# EAGLE design sixteenMotors (EAGLE 7.2.0)
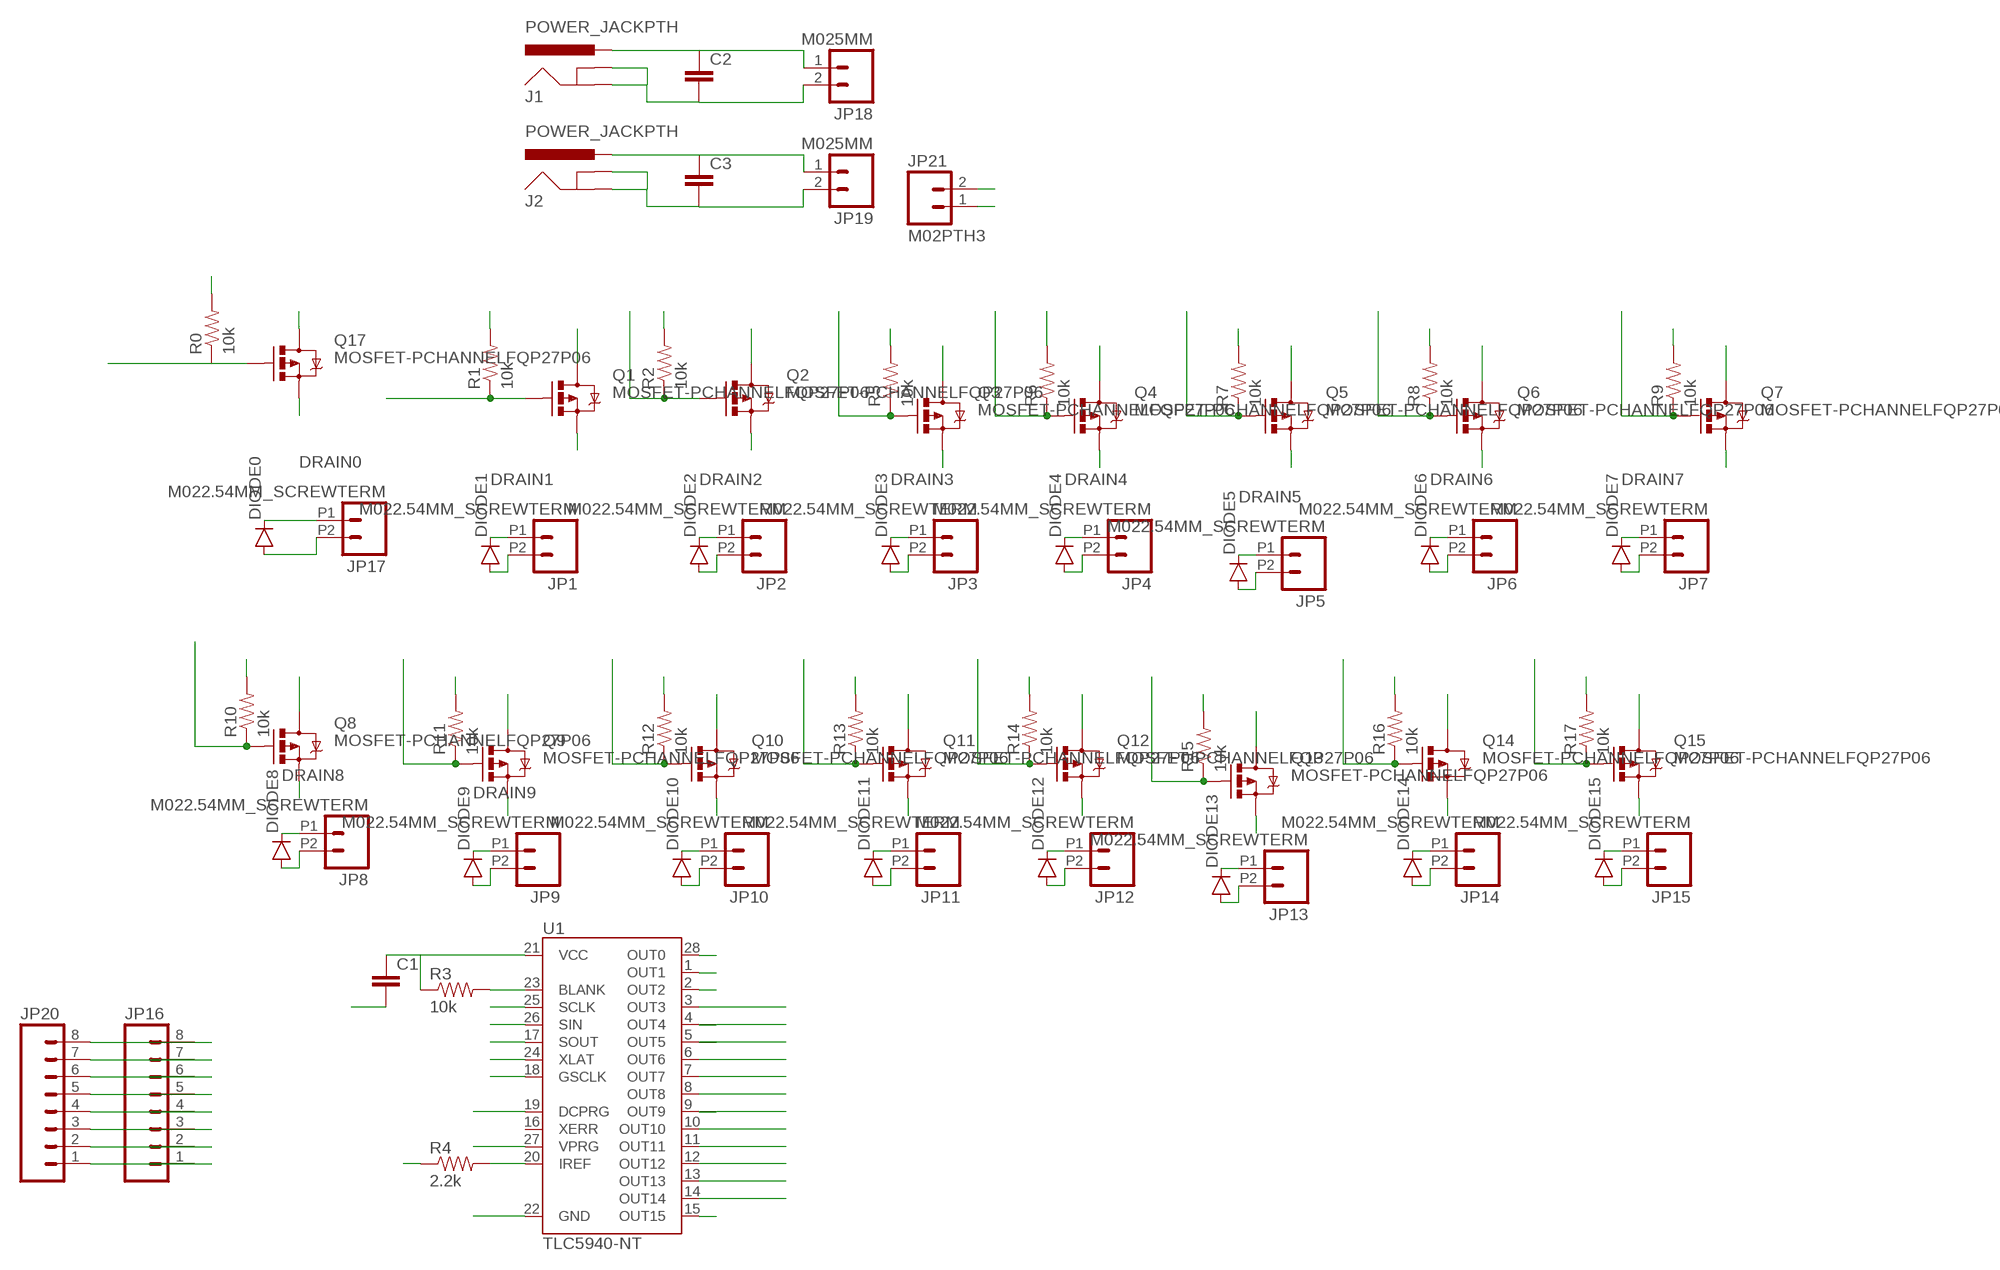
[diagram p0: schematic, sheet 1]

## Parts
C1  CAPEZ  [CAP-PTH-SMALLEZ]
C2  CAPPTH3  [CAP-PTH-LARGE]
C3  CAPPTH3  [CAP-PTH-LARGE]
DIODE0  DIODEPTH  [DIODE-1N4001]
DIODE1  DIODEPTH  [DIODE-1N4001]
DIODE2  DIODEPTH  [DIODE-1N4001]
DIODE3  DIODEPTH  [DIODE-1N4001]
DIODE4  DIODEPTH  [DIODE-1N4001]
DIODE5  DIODEPTH  [DIODE-1N4001]
DIODE6  DIODEPTH  [DIODE-1N4001]
DIODE7  DIODEPTH  [DIODE-1N4001]
DIODE8  DIODEPTH  [DIODE-1N4001]
DIODE9  DIODEPTH  [DIODE-1N4001]
DIODE10  DIODEPTH  [DIODE-1N4001]
DIODE11  DIODEPTH  [DIODE-1N4001]
DIODE12  DIODEPTH  [DIODE-1N4001]
DIODE13  DIODEPTH  [DIODE-1N4001]
DIODE14  DIODEPTH  [DIODE-1N4001]
DIODE15  DIODEPTH  [DIODE-1N4001]
J1  POWER_JACKPTH  [POWER_JACK_PTH]
J2  POWER_JACKPTH  [POWER_JACK_PTH]
JP1  M022.54MM_SCREWTERM  [1X02_2.54_SCREWTERM]
JP2  M022.54MM_SCREWTERM  [1X02_2.54_SCREWTERM]
JP3  M022.54MM_SCREWTERM  [1X02_2.54_SCREWTERM]
JP4  M022.54MM_SCREWTERM  [1X02_2.54_SCREWTERM]
JP5  M022.54MM_SCREWTERM  [1X02_2.54_SCREWTERM]
JP6  M022.54MM_SCREWTERM  [1X02_2.54_SCREWTERM]
JP7  M022.54MM_SCREWTERM  [1X02_2.54_SCREWTERM]
JP8  M022.54MM_SCREWTERM  [1X02_2.54_SCREWTERM]
JP9  M022.54MM_SCREWTERM  [1X02_2.54_SCREWTERM]
JP10  M022.54MM_SCREWTERM  [1X02_2.54_SCREWTERM]
JP11  M022.54MM_SCREWTERM  [1X02_2.54_SCREWTERM]
JP12  M022.54MM_SCREWTERM  [1X02_2.54_SCREWTERM]
JP13  M022.54MM_SCREWTERM  [1X02_2.54_SCREWTERM]
JP14  M022.54MM_SCREWTERM  [1X02_2.54_SCREWTERM]
JP15  M022.54MM_SCREWTERM  [1X02_2.54_SCREWTERM]
JP16  M08  [1X08_PIN1_NO_SILK]
JP17  M022.54MM_SCREWTERM  [1X02_2.54_SCREWTERM]
JP18  M025MM  [SCREWTERMINAL-5MM-2]
JP19  M025MM  [SCREWTERMINAL-5MM-2]
JP20  M08  [1X08_PIN1_NO_SILK]
JP21  M02PTH3  [1X02_LONGPADS]
Q1  MOSFET-PCHANNELFQP27P06  [TO220V]
Q2  MOSFET-PCHANNELFQP27P06  [TO220V]
Q3  MOSFET-PCHANNELFQP27P06  [TO220V]
Q4  MOSFET-PCHANNELFQP27P06  [TO220V]
Q5  MOSFET-PCHANNELFQP27P06  [TO220V]
Q6  MOSFET-PCHANNELFQP27P06  [TO220V]
Q7  MOSFET-PCHANNELFQP27P06  [TO220V]
Q8  MOSFET-PCHANNELFQP27P06  [TO220V]
Q9  MOSFET-PCHANNELFQP27P06  [TO220V]
Q10  MOSFET-PCHANNELFQP27P06  [TO220V]
Q11  MOSFET-PCHANNELFQP27P06  [TO220V]
Q12  MOSFET-PCHANNELFQP27P06  [TO220V]
Q13  MOSFET-PCHANNELFQP27P06  [TO220V]
Q14  MOSFET-PCHANNELFQP27P06  [TO220V]
Q15  MOSFET-PCHANNELFQP27P06  [TO220V]
Q17  MOSFET-PCHANNELFQP27P06  [TO220V]
R0  10k  10KOHM-1/4W5%(PTH)  [AXIAL-0.3]
R1  10k  10KOHM-1/4W5%(PTH)  [AXIAL-0.3]
R2  10k  10KOHM-1/4W5%(PTH)  [AXIAL-0.3]
R3  10k  RESISTORPTH-1/4W  [AXIAL-0.4]
R4  2.2k  RESISTORPTH-1/4W  [AXIAL-0.4]
R5  10k  10KOHM-1/4W5%(PTH)  [AXIAL-0.3]
R6  10k  10KOHM-1/4W5%(PTH)  [AXIAL-0.3]
R7  10k  10KOHM-1/4W5%(PTH)  [AXIAL-0.3]
R8  10k  10KOHM-1/4W5%(PTH)  [AXIAL-0.3]
R9  10k  10KOHM-1/4W5%(PTH)  [AXIAL-0.3]
R10  10k  10KOHM-1/4W5%(PTH)  [AXIAL-0.3]
R11  10k  10KOHM-1/4W5%(PTH)  [AXIAL-0.3]
R12  10k  10KOHM-1/4W5%(PTH)  [AXIAL-0.3]
R13  10k  10KOHM-1/4W5%(PTH)  [AXIAL-0.3]
R14  10k  10KOHM-1/4W5%(PTH)  [AXIAL-0.3]
R15  10k  10KOHM-1/4W5%(PTH)  [AXIAL-0.3]
R16  10k  10KOHM-1/4W5%(PTH)  [AXIAL-0.3]
R17  10k  10KOHM-1/4W5%(PTH)  [AXIAL-0.3]
U1  TLC5940-NT  [DIL28-3]

## Nets
BLANK: JP16.5 JP20.5 R3.P$2 U1.23(BLANK)
DRAIN0: DIODE0.C JP17.P1 Q17.2(D)
DRAIN1: DIODE1.C JP1.P1 Q1.2(D)
DRAIN2: DIODE2.C JP2.P1 Q2.2(D)
DRAIN3: DIODE3.C JP3.P1 Q3.2(D)
DRAIN4: DIODE4.C JP4.P1 Q4.2(D)
DRAIN5: DIODE5.C JP5.P1 Q5.2(D)
DRAIN6: DIODE6.C JP6.P1 Q6.2(D)
DRAIN7: DIODE7.C JP7.P1 Q7.2(D)
DRAIN8: DIODE8.C JP8.P1 Q8.2(D)
DRAIN9: DIODE9.C JP9.P1 Q9.2(D)
DRAIN10: DIODE10.C JP10.P1 Q10.2(D)
DRAIN11: DIODE11.C JP11.P1 Q11.2(D)
DRAIN12: DIODE12.C JP12.P1 Q12.2(D)
DRAIN13: DIODE13.C JP13.P1 Q13.2(D)
DRAIN14: DIODE14.C JP14.P1 Q14.2(D)
DRAIN15: DIODE15.C JP15.P1 Q15.2(D)
GND: C1.2 C2.2 C3.2 DIODE0.A DIODE1.A DIODE2.A DIODE3.A DIODE4.A DIODE5.A DIODE6.A DIODE7.A DIODE8.A DIODE9.A DIODE10.A DIODE11.A DIODE12.A DIODE13.A DIODE14.A DIODE15.A J1.GND J1.GNDBREAK J2.GND J2.GNDBREAK JP1.P2 JP2.P2 JP3.P2 JP4.P2 JP5.P2 JP6.P2 JP7.P2 JP8.P2 JP9.P2 JP10.P2 JP11.P2 JP12.P2 JP13.P2 JP14.P2 JP15.P2 JP16.4 JP17.P2 JP18.2 JP19.2 JP20.4 R4.P$1 U1.22(GND) U1.27(VPRG)
GSCLK: JP16.2 JP20.2 U1.18(GSCLK)
N$2: R4.P$2 U1.20(IREF)
O0: Q17.1(G) R0.P$1 U1.28(OUT0)
O1: Q1.1(G) R1.P$1 U1.1(OUT1)
O2: Q2.1(G) R2.P$1 U1.2(OUT2)
O3: Q3.1(G) R5.P$1 U1.3(OUT3)
O4: Q4.1(G) R6.P$1 U1.4(OUT4)
O5: Q5.1(G) R7.P$1 U1.5(OUT5)
O6: Q6.1(G) R8.P$1 U1.6(OUT6)
O7: Q7.1(G) R9.P$1 U1.7(OUT7)
O8: Q8.1(G) R10.P$1 U1.8(OUT8)
O9: Q9.1(G) R11.P$1 U1.9(OUT9)
O10: Q10.1(G) R12.P$1 U1.10(OUT10)
O11: Q11.1(G) R13.P$1 U1.11(OUT11)
O12: Q12.1(G) R14.P$1 U1.12(OUT12)
O13: Q13.1(G) R15.P$1 U1.13(OUT13)
O14: Q14.1(G) R16.P$1 U1.14(OUT14)
O15: Q15.1(G) R17.P$1 U1.15(OUT15)
POWER1: C2.1 J1.PWR JP18.1 JP21.2 Q1.3(S) Q2.3(S) Q3.3(S) Q4.3(S) Q5.3(S) Q6.3(S) Q7.3(S) Q17.3(S) R0.P$2 R1.P$2 R2.P$2 R5.P$2 R6.P$2 R7.P$2 R8.P$2 R9.P$2
POWER2: C3.1 J2.PWR JP19.1 JP21.1 Q8.3(S) Q9.3(S) Q10.3(S) Q11.3(S) Q12.3(S) Q13.3(S) Q14.3(S) Q15.3(S) R10.P$2 R11.P$2 R12.P$2 R13.P$2 R14.P$2 R15.P$2 R16.P$2 R17.P$2
SCLK: JP16.7 JP20.7 U1.25(SCLK)
SIN: JP16.8 JP20.8 U1.26(SIN)
SOUT: JP16.1 JP20.1 U1.17(SOUT)
VCC: C1.1 JP16.3 JP20.3 R3.P$1 U1.19(DCPRG) U1.21(VCC)
XLAT: JP16.6 JP20.6 U1.24(XLAT)
Unconnected: U1.16(XERR)

## Library data of the parts
C1 = SparkFun-Passives:CAP: Capacitor Standard 0603 ceramic capacitor, and 0.1" leaded capacitor.
C2 C3 = SparkFun-Capacitors:CAP: Capacitor Standard 0603 ceramic capacitor, and 0.1" leaded capacitor.
DIODE0 DIODE1-DIODE15 = SparkFun-DiscreteSemi:DIODE: Diode These are standard reverse protection diodes and small signal diodes. SMA package can handle up to about 1A. SOD-323 can handle about 200mA. What the SOD-323 package when ordering, there are some mfgs out there that are 5-pin packages.
J1 J2 = SparkFun-Connectors:POWER_JACK: Power Jack This is the standard 5.5mm barrel jack for power. The PTH is the most common, proven, reliable, footprint. The Slot footprint only works if the mill layer is transmitted to the PCB fab house so be warned. Mating wall wart : TOL-00298 (and others); PROD_ID: PRT-00119
JP1-JP15 JP17 JP21 = SparkFun-Connectors:M02: Standard 2-pin 0.1" header. Use with - straight break away headers ( PRT-00116) - right angle break away headers (PRT-00553) - swiss pins (PRT-00743) - machine pins (PRT-00117) - female headers (PRT-00115) Molex polarized connector foot print use with: PRT-08233 with associated crimp pins and housings. 2.54_SCREWTERM for use with PRT-10571. 3.5mm Screw Terminal footprints for PRT-08084 5mm Screw Terminal footprints for use with PRT-08432
JP16 JP20 = SparkFun-Connectors:M08: Header 8 Standard 8-pin 0.1" header. Use with straight break away headers (SKU : PRT-00116), right angle break away headers (PRT-00553), swiss pins (PRT-00743), machine pins (PRT-00117), and female headers (PRT-00115).
JP18 JP19 = SparkFun-Connectors:M02: Standard 2-pin 0.1" header. Use with - straight break away headers ( PRT-00116) - right angle break away headers (PRT-00553) - swiss pins (PRT-00743) - machine pins (PRT-00117) - female headers (PRT-00115) Molex polarized connector foot print use with: PRT-08233 with associated crimp pins and housings. 2.54_SCREWTERM for use with PRT-10571. 3.5mm Screw Terminal footprints for PRT-08084 5mm Screw Terminal footprints for use with PRT-08432; STOREFRONT_ID: PRT-08432
Q1-Q15 Q17 = SparkFun-DiscreteSemi:MOSFET-PCHANNEL: Generic PMOSFET IRLML2244 - TRANS-11153 (SOT-23 -20V -4.3A) (1.Gate 2.Source 3.Drain) FQP27P06 - COM-10349 <http://www.sparkfun.com/products/10349> (TO-220 -60V -27A) (1.Gate 2.Source 3.Drain)
R0 R1 R2 R5-R17 = SparkFun-Resistors:10KOHM-1/4W5%(PTH): RES-09435; PROD_ID: RES-9435
R3 R4 = SparkFun-Passives:RESISTOR: Resistor Basic schematic elements and footprints for 0603, 1206, and PTH resistors.
U1 = SparkFun-DigitalIC:TLC5940: 16-channel LED Driver with Dot Correction and Grayscale PWM Control The TLC5940 is a 16-channel, constant-current sink LED driver. Each channel has an individually adjustable 4096-step grayscale PWM brightness control and a 64-step, constant-current sink (dot correction). The dot correction adjusts the brightness variations between LED channels and other LED drivers. The dot correction data is stored in an integrated EEPROM. Both grayscale control and dot correction are accessible via a serial interface. A single external resistor sets the maximum current value of all 16 channels. Packages: 28-pin HTSSOP 32-pin 5x5mm QFN 28-pin DIP

## Board
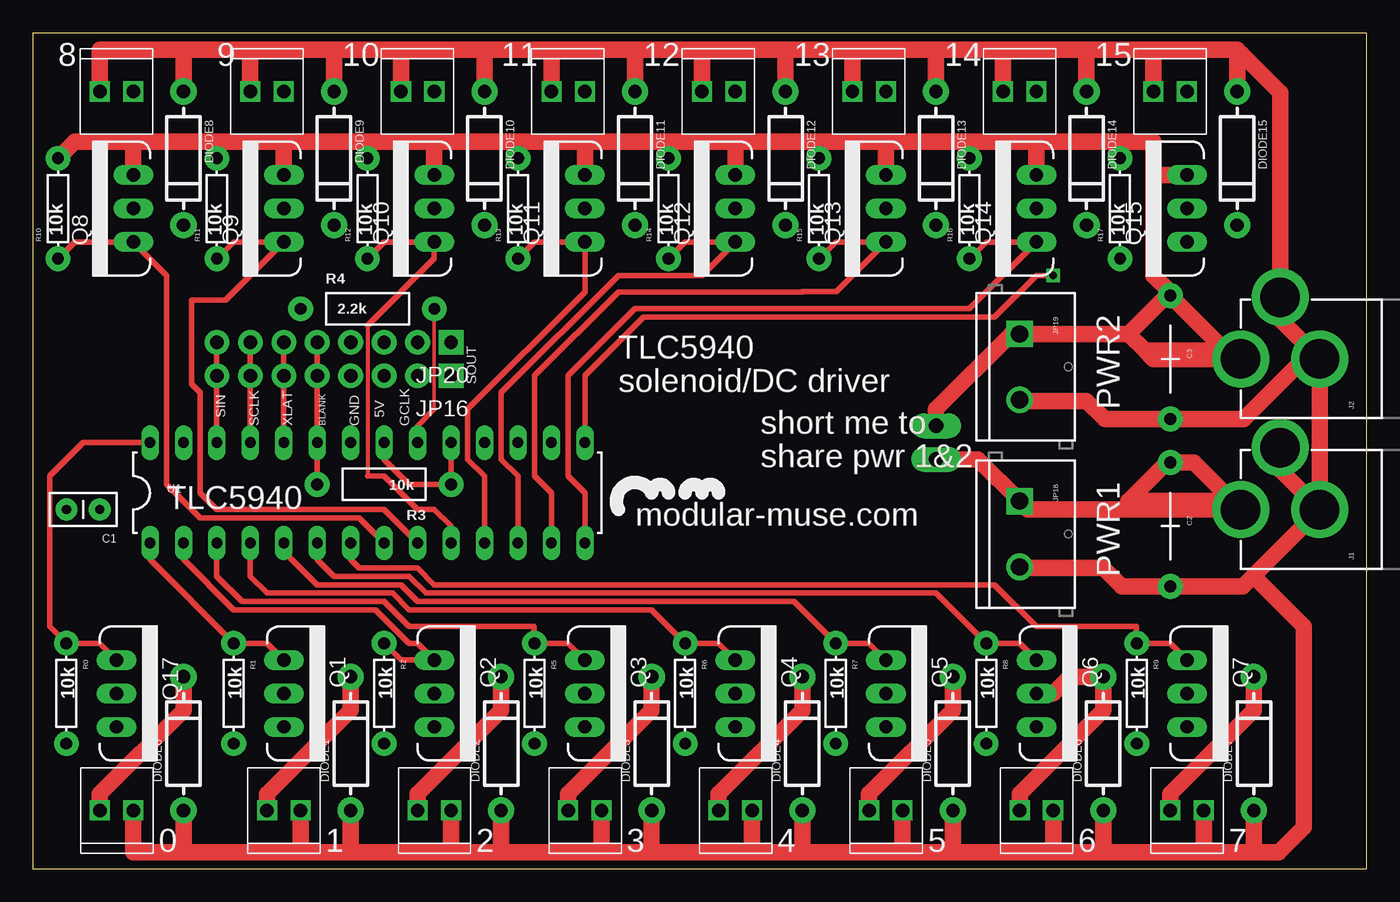
[diagram p1: board, top side]
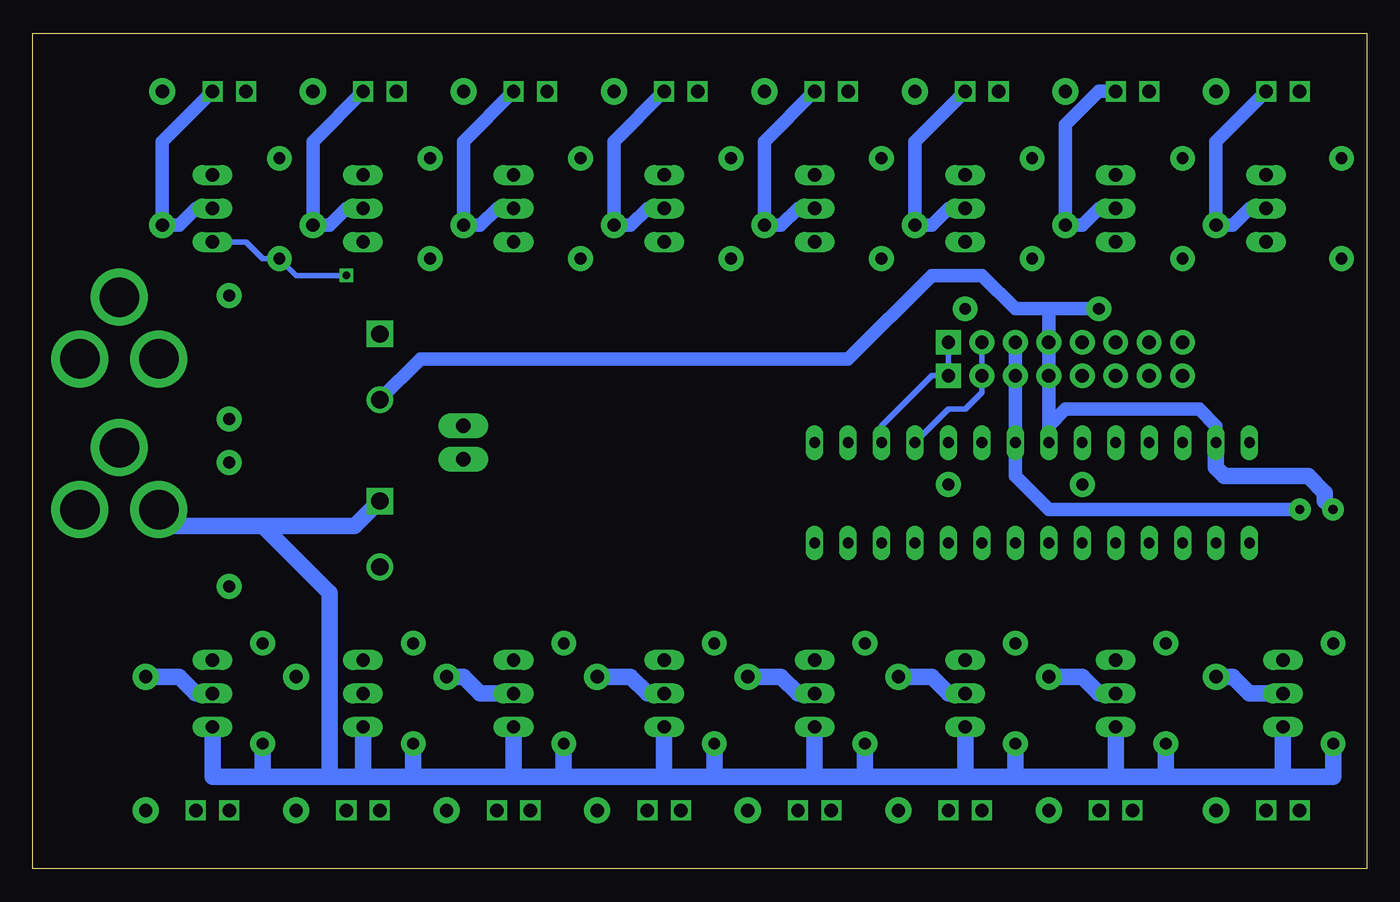
[diagram p2: board, bottom side, seen from below]

Size 101.27 x 63.49 mm. Coordinates in mm from the lower left corner, seen from the top.
Outline: 0,0 101.27,0 101.27,63.49 0,63.49 0,0
Copper layers (1*16): Top 0.035mm / dielectric 1.5mm / Bottom 0.035mm
Design rules "default": minimum track width 10mil, minimum drill 24mil, track to track 8mil, track to pad 8mil, pad to pad 8mil, via to via 8mil, smd to smd 8mil, copper to edge 40mil, drill to drill 8mil, minimum pad ring 10mil, minimum via ring 8mil, stop-mask expansion 4mil, vias tented up to drill 0mil, thermal gap 10mil

### Footprints (pad centres in the part's own frame; a part is rotated, then mirrored left to right if it is on the bottom)
CAP-PTH-SMALLEZ = drill 0.7 pad 1.651: 1 0,0; 2 2.54,0
CAP-PTH-LARGE = drill 0.9 pad 1.905: 1 -4.826,0; 2 4.572,0
DIODE-1N4001 = drill 1 pad 1.981: A -5.08,0; C 5.08,0
POWER_JACK_PTH = drill 2.997 pad 4.318: GND 0,7.7; GNDBREAK 4.7,10.7; PWR 0,13.7
1X02_2.54_SCREWTERM = drill 1.016 square: P1 2.54,0; P2 0,0
1X08_PIN1_NO_SILK = drill 1.016 pad 1.88 square: 1 0,0 | drill 1.016 pad 1.88: 2 2.54,0; 3 5.08,0; 4 7.62,0; 5 10.16,0; 6 12.7,0; 7 15.24,0; 8 17.78,0
SCREWTERMINAL-5MM-2 = drill 1.3 pad 2.032 square: 1 0,0 | drill 1.3 pad 2.032: 2 5,0
1X02_LONGPADS = drill 1.118 pad 1.88 long: 1 0,0; 2 2.54,0
TO220V = drill 1.016 long: 1 -2.54,0; 2 0,0; 3 2.54,0
AXIAL-0.3 = drill 0.9 pad 1.88: P$1 -3.81,0; P$2 3.81,0
AXIAL-0.4 = drill 0.9 pad 1.88: P$1 -5.08,0; P$2 5.08,0
DIL28-3 = drill 0.813 long: 1 -16.51,-3.81; 2 -13.97,-3.81; 3 -11.43,-3.81; 4 -8.89,-3.81; 5 -6.35,-3.81; 6 -3.81,-3.81; 7 -1.27,-3.81; 8 1.27,-3.81; 9 3.81,-3.81; 10 6.35,-3.81; 11 8.89,-3.81; 12 11.43,-3.81; 13 13.97,-3.81; 14 16.51,-3.81; 15 16.51,3.81; 16 13.97,3.81; 17 11.43,3.81; 18 8.89,3.81; 19 6.35,3.81; 20 3.81,3.81; 21 1.27,3.81; 22 -1.27,3.81; 23 -3.81,3.81; 24 -6.35,3.81; 25 -8.89,3.81; 26 -11.43,3.81; 27 -13.97,3.81; 28 -16.51,3.81

### Placement (x,y rotation side)
C1  5.08,27.3 180 top
C2  86.36,26.03 270 top
C3  86.36,38.73 270 top
DIODE0  11.43,9.52 90 top
DIODE1  24.13,9.52 90 top
DIODE2  35.56,9.52 90 top
DIODE3  46.99,9.52 90 top
DIODE4  58.42,9.52 90 top
DIODE5  69.85,9.52 90 top
DIODE6  81.28,9.52 90 top
DIODE7  92.71,9.52 90 top
DIODE8  11.43,53.98 270 top
DIODE9  22.86,53.98 270 top
DIODE10  34.29,53.98 270 top
DIODE11  45.72,53.98 270 top
DIODE12  57.15,53.98 270 top
DIODE13  68.58,53.98 270 top
DIODE14  80.01,53.98 270 top
DIODE15  91.44,53.98 270 top
J1  105.41,27.3 90 top
J2  105.41,38.73 90 top
JP1  20.32,4.45 180 top
JP2  31.75,4.45 180 top
JP3  43.18,4.45 180 top
JP4  54.61,4.45 180 top
JP5  66.04,4.45 180 top
JP6  77.47,4.45 180 top
JP7  88.9,4.45 180 top
JP8  5.08,59.05 0 top
JP9  16.51,59.05 0 top
JP10  27.94,59.05 0 top
JP11  39.37,59.05 0 top
JP12  50.8,59.05 0 top
JP13  62.23,59.05 0 top
JP14  73.66,59.05 0 top
JP15  85.09,59.05 0 top
JP16  31.75,37.46 180 top
JP17  7.62,4.45 180 top
JP18  74.93,27.94 270 top
JP19  74.93,40.64 270 top
JP20  31.75,40.01 180 top
JP21  68.58,33.66 270 top
Q1  19.05,13.34 270 top
Q2  30.48,13.34 270 top
Q3  41.91,13.34 270 top
Q4  53.34,13.34 270 top
Q5  64.77,13.34 270 top
Q6  76.2,13.34 270 top
Q7  87.63,13.34 270 top
Q8  7.62,50.16 90 top
Q9  19.05,50.16 90 top
Q10  30.48,50.16 90 top
Q11  41.91,50.16 90 top
Q12  53.34,50.16 90 top
Q13  64.77,50.16 90 top
Q14  76.2,50.16 90 top
Q15  87.63,50.16 90 top
Q17  6.35,13.34 270 top
R0  2.54,13.34 270 top
R1  15.24,13.34 270 top
R2  26.67,13.34 270 top
R3  26.67,29.21 180 top
R4  25.4,42.55 0 top
R5  38.1,13.34 270 top
R6  49.53,13.34 270 top
R7  60.96,13.34 270 top
R8  72.39,13.34 270 top
R9  83.82,13.34 270 top
R10  1.91,50.16 90 top
R11  13.97,50.16 90 top
R12  25.4,50.16 90 top
R13  36.83,50.16 90 top
R14  48.26,50.16 90 top
R15  59.69,50.16 90 top
R16  71.12,50.16 90 top
R17  82.55,50.16 90 top
U1  25.4,28.57 0 top

### Tracks (layer width: path | path; a pad name or v marks a point on that pad's centre or on a via)
BLANK
  Top 0.406: U1.23 R3.P$2 JP16.5 JP20.5
DRAIN0
  Top 1.27: JP17.P1 5.08,5.71 11.43,12.06 DIODE0.C
  Bottom 1.27: Q17.2 8.89,13.34 10.16,14.61 DIODE0.C
DRAIN1
  Top 1.27: JP1.P1 17.78,5.71 24.13,12.06 DIODE1.C
  Bottom 1.27: Q1.2 20.32,13.34 21.59,14.61 DIODE1.C
DRAIN2
  Top 1.27: JP2.P1 29.21,5.71 35.56,12.06 DIODE2.C
  Bottom 1.27: Q2.2 31.75,13.34 33.02,14.61 DIODE2.C
DRAIN3
  Top 1.27: JP3.P1 40.64,5.71 46.99,12.06 DIODE3.C
  Bottom 1.27: Q3.2 43.18,13.34 44.45,14.61 DIODE3.C
DRAIN4
  Top 1.27: JP4.P1 52.07,5.71 58.42,12.06 DIODE4.C
  Bottom 1.27: Q4.2 54.61,13.34 55.88,14.61 DIODE4.C
DRAIN5
  Top 1.27: JP5.P1 63.5,5.71 69.85,12.06 DIODE5.C
  Bottom 1.27: Q5.2 67.31,13.34 68.58,14.61 DIODE5.C
DRAIN6
  Top 1.27: JP6.P1 74.93,5.71 81.28,12.06 DIODE6.C 78.74,14.61 77.47,13.34 Q6.2
DRAIN7
  Top 1.27: JP7.P1 86.36,5.71 92.71,12.06 DIODE7.C
  Bottom 1.27: Q7.2 88.9,13.34 90.17,14.61 DIODE7.C
DRAIN8
  Bottom 1.016: JP8.P1 11.43,55.24 DIODE8.C 10.16,48.89 8.89,50.16 Q8.2
DRAIN9
  Bottom 1.016: Q9.2 20.32,50.16 21.59,48.89 DIODE9.C 22.86,56.51 20.32,59.05 JP9.P1
DRAIN10
  Bottom 1.016: JP10.P1 34.29,55.24 DIODE10.C 33.02,48.89 31.75,50.16 Q10.2
DRAIN11
  Bottom 1.016: JP11.P1 45.72,55.24 DIODE11.C 44.45,48.89 43.18,50.16 Q11.2
DRAIN12
  Bottom 1.016: JP12.P1 57.15,55.24 DIODE12.C 55.88,48.89 54.61,50.16 Q12.2
DRAIN13
  Bottom 1.016: JP13.P1 68.58,55.24 DIODE13.C 67.31,48.89 66.04,50.16 Q13.2
DRAIN14
  Bottom 1.016: JP14.P1 80.01,55.24 DIODE14.C 78.74,48.89 77.47,50.16 Q14.2
DRAIN15
  Bottom 1.016: JP15.P1 91.44,55.24 DIODE15.C 90.17,48.89 88.9,50.16 Q15.2
GND
  Top 1.27: 91.76,61.91 94.71,58.96 J2.GNDBREAK 94.71,41.73 97.11,39.33 | 91.76,61.91 91.44,62.23 85.09,62.23 | 85.09,62.23 80.01,62.23 | 80.01,62.23 73.66,62.23 | 73.66,62.23 68.58,62.23 | 68.58,62.23 62.23,62.23 | 62.23,62.23 57.15,62.23 | 57.15,62.23 50.8,62.23 | 50.8,62.23 45.72,62.23 | 45.72,62.23 39.37,62.23 | 39.37,62.23 34.29,62.23 | 34.29,62.23 27.94,62.23 | 27.94,62.23 22.86,62.23 | 22.86,62.23 16.51,62.23 | 16.51,62.23 11.43,62.23 | 11.43,62.23 5.08,62.23 JP8.P2 | DIODE8.A 11.43,62.23 | JP9.P2 16.51,62.23 | JP10.P2 27.94,62.23 | DIODE11.A 45.72,62.23 | JP12.P2 50.8,62.23 | DIODE12.A 57.15,62.23 | JP13.P2 62.23,62.23 | DIODE13.A 68.58,62.23 | JP14.P2 73.66,62.23 | DIODE14.A 80.01,62.23 | JP15.P2 85.09,62.23 | DIODE15.A 91.44,61.6 91.76,61.91 | 97.11,39.33 J2.GND J1.GND | J1.GNDBREAK 94.71,30.3 J1.GND | 92.67,22.27 91.87,21.46 C2.2 82.68,21.46 81.28,22.86 75.01,22.86 JP18.2 | 92.67,22.27 J1.GND | 97.11,39.33 91.95,34.16 C3.2 81.41,34.16 80.01,35.56 75.01,35.56 JP19.2 | DIODE7.A 92.71,1.27 | 92.71,1.27 88.9,1.27 | 88.9,1.27 81.28,1.27 | 81.28,1.27 77.47,1.27 | 77.47,1.27 69.85,1.27 | 69.85,1.27 66.04,1.27 | 66.04,1.27 58.42,1.27 | 58.42,1.27 54.61,1.27 | 54.61,1.27 46.99,1.27 | 46.99,1.27 43.18,1.27 | 43.18,1.27 35.56,1.27 | 35.56,1.27 31.75,1.27 | 31.75,1.27 24.13,1.27 | 24.13,1.27 20.32,1.27 | 20.32,1.27 11.43,1.27 | 11.43,1.27 7.62,1.27 JP17.P2 | DIODE0.A 11.43,1.27 | JP1.P2 20.32,1.27 | DIODE1.A 24.13,1.27 | JP2.P2 31.75,1.27 | DIODE2.A 35.56,1.27 | JP3.P2 43.18,1.27 | DIODE3.A 46.99,1.27 | JP4.P2 54.61,1.27 | DIODE4.A 58.42,1.27 | JP5.P2 66.04,1.27 | DIODE5.A 69.85,1.27 | JP6.P2 77.47,1.27 | DIODE6.A 81.28,1.27 | JP7.P2 88.9,1.27 | 92.67,22.27 96.52,18.41 96.52,3.18 94.61,1.27 92.71,1.27
  Top 1.27: JP11.P2 39.37,62.23 | DIODE10.A 34.29,62.23 | DIODE9.A 22.86,62.23
  Bottom 1.016: U1.27 11.43,33.66 12.7,34.92 22.86,34.92 24.13,33.66 U1.22 JP16.4 JP20.4 24.13,42.55 | R4.P$1 24.13,42.55 | 24.13,42.55 26.67,42.55 29.21,45.09 33.02,45.09 39.37,38.73 71.83,38.73 JP19.2
  Bottom 1.27: U1.27 11.43,30.48 10.79,29.84 4.45,29.84 3.17,28.57 3.17,27.94 C1.2
GSCLK
  Bottom 0.406: U1.18 31.75,34.92 30.48,34.92 29.21,36.2 JP16.2 JP20.2
N$2
  Top 0.254: 30.48,34.92 R4.P$2
  Top 0.406: U1.20 29.21,33.66 30.48,34.92
O0
  Top 0.406: U1.28 3.81,32.38 1.27,29.84 1.27,18.41 R0.P$1 5.08,17.14 Q17.1
O1
  Top 0.406: U1.1 8.89,23.49 R1.P$1 17.78,17.14 Q1.1
O2
  Top 0.406: U1.2 11.43,23.49 15.24,19.69 26.04,19.69 28.57,17.14 29.21,17.14 Q2.1 27.94,15.88 R2.P$1
O3
  Top 0.406: U1.3 13.97,22.23 15.88,20.32 26.67,20.32 28.57,18.41 38.06,18.41 38.06,17.18 R5.P$1 40.64,17.14 Q3.1
O4
  Top 0.406: U1.4 16.51,22.23 17.78,20.95 27.3,20.95 28.57,19.69 46.99,19.69 R6.P$1 52.07,17.14 Q4.1
O5
  Top 0.406: U1.5 19.05,24.13 21.59,21.59 27.94,21.59 29.21,20.32 57.78,20.32 R7.P$1 63.5,17.14 Q5.1
O6
  Top 0.406: U1.6 21.59,23.49 22.86,22.23 28.57,22.23 29.84,20.95 68.58,20.95 R8.P$1 74.93,17.14 Q6.1
O7
  Top 0.406: U1.7 24.13,23.49 24.77,22.86 29.21,22.86 30.48,21.59 73.03,21.59 76.2,18.41 83.78,18.41 83.78,17.18 R9.P$1 86.36,17.14 Q7.1
O8
  Top 0.406: U1.8 24.77,26.67 12.7,26.67 10.16,29.21 10.16,45.09 Q8.1 3.17,47.62 R10.P$1
O9
  Top 0.406: U1.9 26.67,27.3 13.97,27.3 12.7,28.57 12.7,36.2 12.06,36.83 12.06,43.22 14.64,43.22 Q9.1 15.24,47.62 R11.P$1
O10
  Top 0.305: 25.4,41.27 25.4,29.84
  Top 0.406: 25.4,29.84 26.67,29.84 29.21,27.3 30.48,27.3 31.75,26.03 U1.10 | 25.4,41.27 30.48,46.35 Q10.1 26.67,47.62 R12.P$1
O11
  Top 0.406: U1.11 34.29,29.84 33.02,31.12 33.02,34.92 41.91,43.81 Q11.1 38.1,47.62 R13.P$1
O12
  Top 0.406: U1.12 36.83,29.84 35.56,31.12 35.56,36.2 44.45,45.09 50.8,45.09 Q12.1 49.53,47.62 R14.P$1
O13
  Top 0.406: U1.13 39.37,28.57 38.1,29.84 38.1,37.46 44.45,43.81 58.42,43.81 58.42,43.85 61,43.85 Q13.1 60.96,47.62 R15.P$1
O14
  Top 0.406: U1.14 41.91,28.57 40.64,29.84 40.64,37.46 45.72,42.55 71.12,42.55 Q14.1 72.39,47.62 R16.P$1
O15  (via drill 0.6)
  Top 0.406: U1.15 41.91,37.46 46.35,41.91 73.03,41.91 76.2,45.09 v77.47,45.09
  Bottom 0.406: v77.47,45.09 81.28,45.09 R17.P$1 83.82,46.35 85.09,47.62 Q15.1
POWER1
  Top 1.27: J1.PWR 88.15,30.86 C2.1 86.11,30.86 83.19,27.94 90.81,27.94 91.44,27.3 75.56,27.3 JP18.1 71.75,31.12 JP21.2
  Bottom 1.27: R9.P$2 83.82,6.98 | 83.82,6.98 78.74,6.98 | 76.2,6.98 72.39,6.98 | 72.39,6.98 64.77,6.98 | 64.77,6.98 60.96,6.98 | 60.96,6.98 53.34,6.98 | 53.34,6.98 49.53,6.98 | 49.53,6.98 41.91,6.98 | 41.91,6.98 38.1,6.98 | 38.1,6.98 30.48,6.98 | 30.48,6.98 26.67,6.98 | 26.67,6.98 19.05,6.98 | 19.05,6.98 15.24,6.98 | 15.24,6.98 6.35,6.98 | 6.35,6.98 2.54,6.98 R0.P$2 | Q17.3 6.35,6.98 | R1.P$2 15.24,6.98 | Q1.3 19.05,6.98 | R2.P$2 26.67,6.98 | Q2.3 30.48,6.98 | R5.P$2 38.1,6.98 | Q3.3 41.91,6.98 | R6.P$2 49.53,6.98 | Q4.3 53.34,6.98 | R7.P$2 60.96,6.98 | Q5.3 64.77,6.98 | R8.P$2 72.39,6.98 | 83.82,6.98 87.63,6.98 Q7.3 | Q6.3 76.2,6.98 | 76.2,6.98 78.74,6.98 | 78.74,6.98 78.74,20.95 83.82,26.03 | 83.82,26.03 91.44,26.03 | 83.82,26.03 76.83,26.03 JP18.1
POWER2
  Top 1.27: J2.PWR 91.44,38.73 | 91.44,38.73 91.19,38.73 | 91.19,38.73 C3.1 | C3.1 86.11,43.56 83.19,40.64 | 83.19,40.64 84.45,39.37 | 84.45,39.37 90.81,39.37 91.44,38.73 | 91.19,38.73 85.09,38.73 84.45,39.37 | 83.19,40.64 JP19.1 74.3,40.64 68.58,34.92 JP21.1 | C3.1 86.36,43.81 85.09,45.09 85.09,52.71 | 85.09,52.71 85.09,55.24 82.55,55.24 | 82.55,55.24 76.2,55.24 | 76.2,55.24 71.12,55.24 | 71.12,55.24 64.77,55.24 | 64.77,55.24 59.69,55.24 | 59.69,55.24 53.34,55.24 | 53.34,55.24 48.26,55.24 | 48.26,55.24 41.91,55.24 | 41.91,55.24 36.83,55.24 | 36.83,55.24 30.48,55.24 | 30.48,55.24 25.4,55.24 | 25.4,55.24 19.05,55.24 | 19.05,55.24 13.97,55.24 | 13.97,55.24 7.62,55.24 | 7.62,55.24 Q8.3 | 7.62,55.24 3.17,55.24 R10.P$2 | R12.P$2 25.4,55.24 | R13.P$2 36.83,55.24 | R14.P$2 48.26,55.24 | R15.P$2 59.69,55.24 | R16.P$2 71.12,55.24 | R17.P$2 82.55,55.24 | Q15.3 85.09,52.71 | Q14.3 76.2,55.24 | Q13.3 64.77,55.24 | Q12.3 53.34,55.24 | Q11.3 41.91,55.24 | Q10.3 30.48,55.24 | Q9.3 19.05,55.24 | R11.P$2 13.97,55.24
SCLK
  Top 0.406: U1.25 JP16.7 JP20.7
SIN
  Top 0.406: U1.26 JP16.8 JP20.8
SOUT
  Bottom 0.406: U1.17 36.83,33.66 33.02,37.46 JP16.1 JP20.1
VCC
  Top 0.406: U1.21 26.67,31.12 28.57,29.21 R3.P$1 U1.19
  Bottom 1.016: C1.1 24.13,27.3 26.67,29.84 U1.21 JP16.3 JP20.3
XLAT
  Top 0.406: U1.24 JP16.6 JP20.6

### Text on the board
tPlace: 8 | 9 | 10 | 11 | 12 | 13 | 14 | 15 | TLC5940 | SOUT | solenoid/DC driver | SIN | 5V | PWR2 | SCLK | XLAT | BLANK | GND | GCLK | short me to | share pwr 1&2 | TLC5940 | modular-muse.com | PWR1 | 0 | 1 | 2 | 3 | 4 | 5 | 6 | 7